# EAGLE design AVR Bus Controller (EAGLE 5.06)
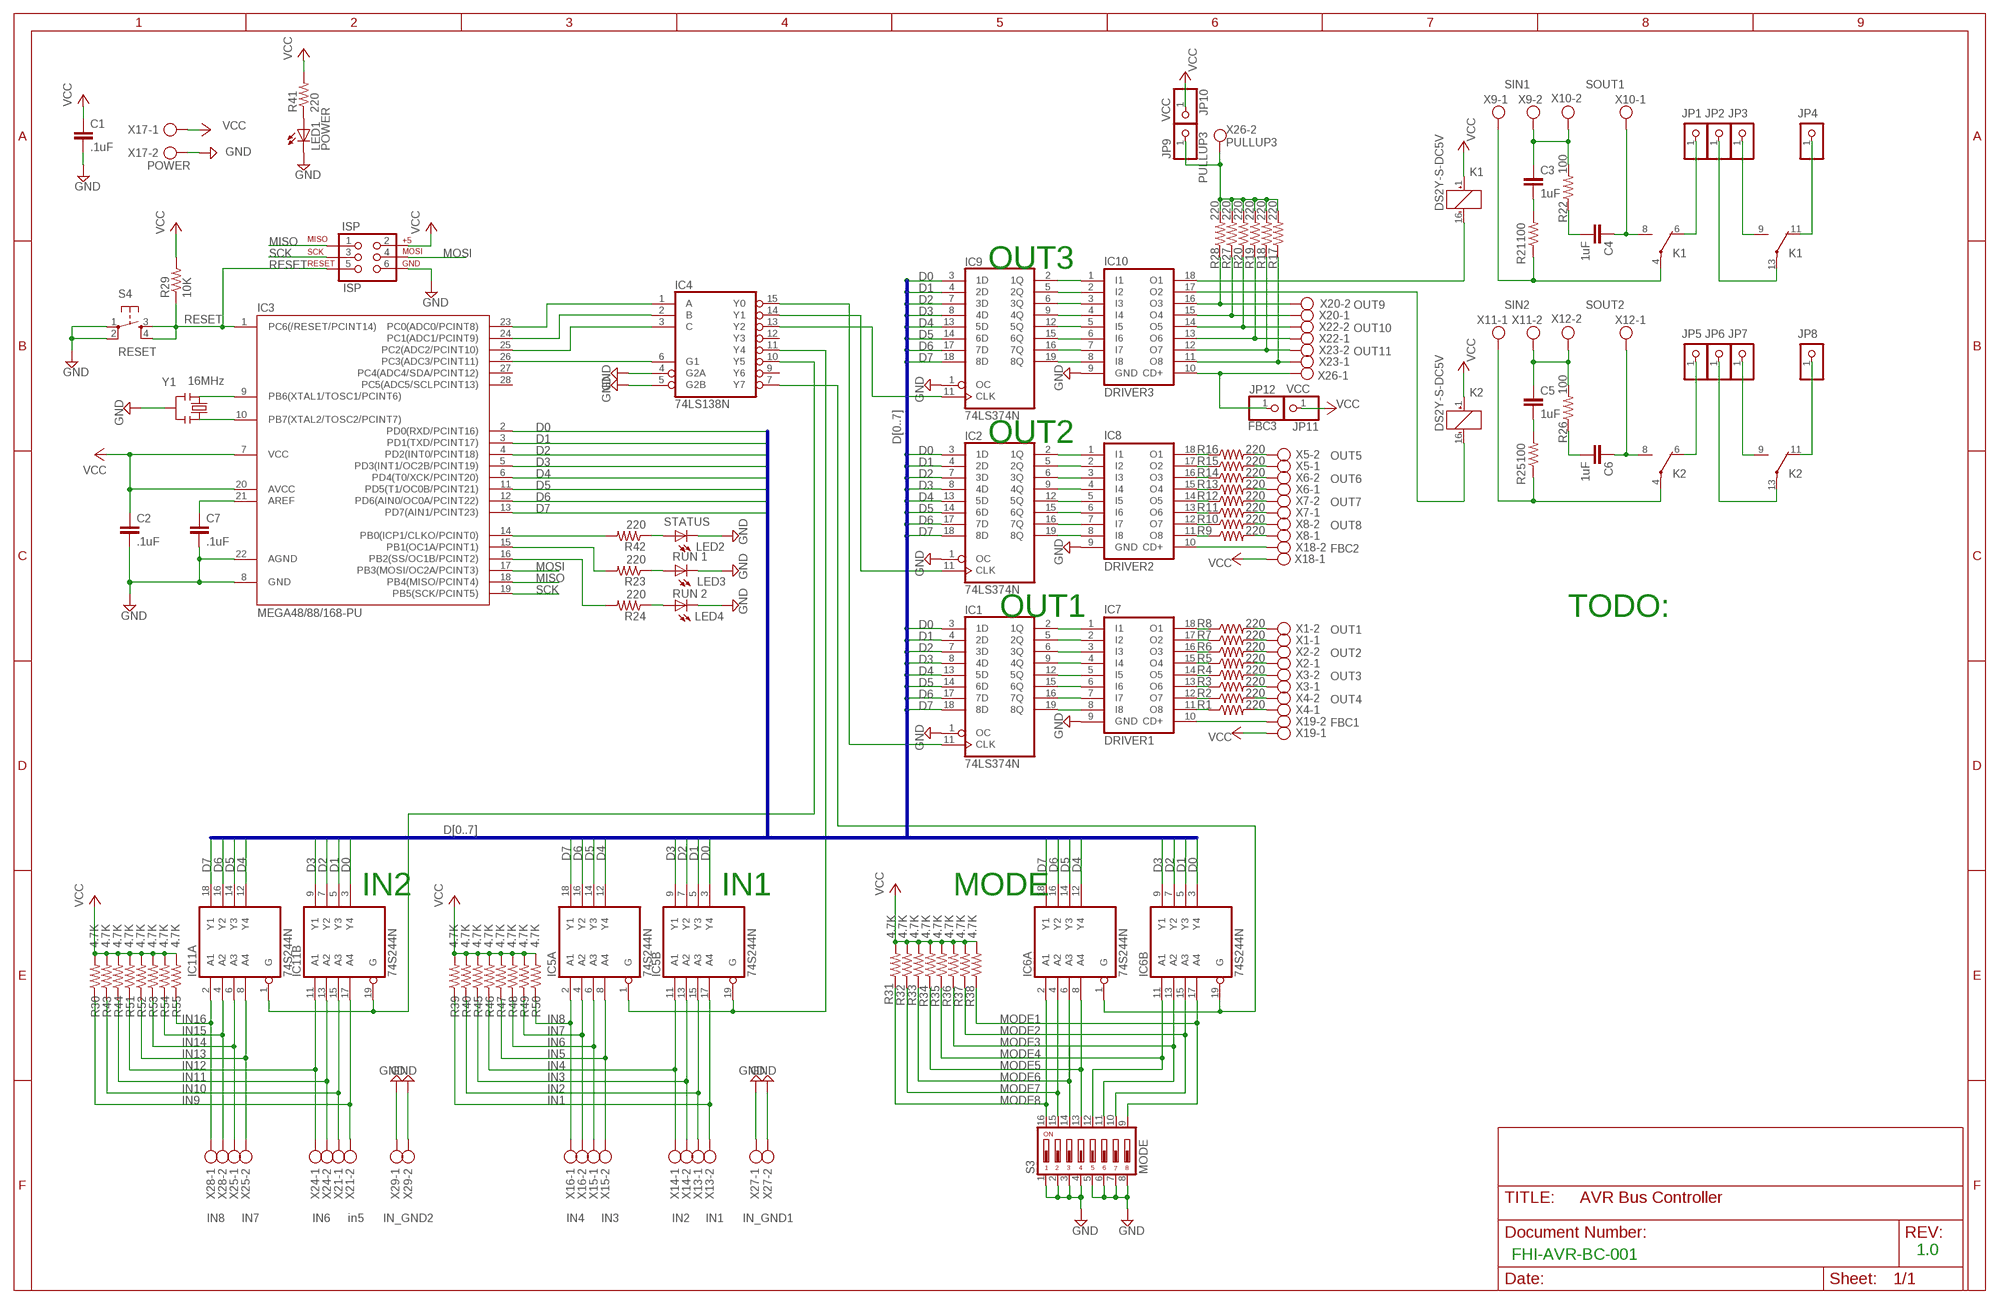
[diagram p0: schematic, sheet 1]

## Parts
C1  .1uF  C-EU025-025X050  [C025-025X050]
C2  .1uF  C-EU025-025X050  [C025-025X050]
C3  1uF  C-EU025-025X050  [C025-025X050]
C4  1uF  C-EU025-025X050  [C025-025X050]
C5  1uF  C-EU025-025X050  [C025-025X050]
C6  1uF  C-EU025-025X050  [C025-025X050]
C7  .1uF  C-EU025-025X050  [C025-025X050]
IC1  74LS374N  [DIL20]
IC2  74LS374N  [DIL20]
IC3  MEGA48/88/168-PU  [DIL28-3]
IC4  74LS138N  [DIL16]
IC5  74S244N  [DIL20]
IC6  74S244N  [DIL20]
IC7  DRIVER1  ULN2803A  [DIL18]
IC8  DRIVER2  ULN2803A  [DIL18]
IC9  74LS374N  [DIL20]
IC10  DRIVER3  ULN2803A  [DIL18]
IC11  74S244N  [DIL20]
ISP  ISP  AVR_SPI_PRG_6PTH  [2X3]
JP1  R1_NC1  PINHD-1X1  [1X01]
JP2  R1_NC1  PINHD-1X1  [1X01]
JP3  R1_NC1  PINHD-1X1  [1X01]
JP4  R1_NC1  PINHD-1X1  [1X01]
JP5  R1_NC1  PINHD-1X1  [1X01]
JP6  R1_NC1  PINHD-1X1  [1X01]
JP7  R1_NC1  PINHD-1X1  [1X01]
JP8  R1_NC1  PINHD-1X1  [1X01]
JP9  PULLUP3  PINHD-1X1  [1X01]
JP10  VCC  PINHD-1X1  [1X01]
JP11  VCC  PINHD-1X1  [1X01]
JP12  FBC3  PINHD-1X1  [1X01]
K1  DS2Y-S-DC5V  [DS2Y]
K2  DS2Y-S-DC5V  [DS2Y]
LED1  POWER  LED5MM  [LED5MM]
LED2  STATUS  LED5MM  [LED5MM]
LED3  RUN 1  LED5MM  [LED5MM]
LED4  RUN 2  LED5MM  [LED5MM]
R1  220  R-US_0207/2V  [0207/2V]
R2  220  R-US_0207/2V  [0207/2V]
R3  220  R-US_0207/2V  [0207/2V]
R4  220  R-US_0207/2V  [0207/2V]
R5  220  R-US_0207/2V  [0207/2V]
R6  220  R-US_0207/2V  [0207/2V]
R7  220  R-US_0207/2V  [0207/2V]
R8  220  R-US_0207/2V  [0207/2V]
R9  220  R-US_0207/2V  [0207/2V]
R10  220  R-US_0207/2V  [0207/2V]
R11  220  R-US_0207/2V  [0207/2V]
R12  220  R-US_0207/2V  [0207/2V]
R13  220  R-US_0207/2V  [0207/2V]
R14  220  R-US_0207/2V  [0207/2V]
R15  220  R-US_0207/2V  [0207/2V]
R16  220  R-US_0207/2V  [0207/2V]
R17  220  R-US_0207/2V  [0207/2V]
R18  220  R-US_0207/2V  [0207/2V]
R19  220  R-US_0207/2V  [0207/2V]
R20  220  R-US_0207/2V  [0207/2V]
R21  100  R-US_0207/2V  [0207/2V]
R22  100  R-US_0207/2V  [0207/2V]
R23  220  R-US_0207/2V  [0207/2V]
R24  220  R-US_0207/2V  [0207/2V]
R25  100  R-US_0207/2V  [0207/2V]
R26  100  R-US_0207/2V  [0207/2V]
R27  220  R-US_0207/2V  [0207/2V]
R28  220  R-US_0207/2V  [0207/2V]
R29  10K  R-US_0207/2V  [0207/2V]
R30  4.7K  R-US_0207/2V  [0207/2V]
R31  4.7K  R-US_0207/2V  [0207/2V]
R32  4.7K  R-US_0207/2V  [0207/2V]
R33  4.7K  R-US_0207/2V  [0207/2V]
R34  4.7K  R-US_0207/2V  [0207/2V]
R35  4.7K  R-US_0207/2V  [0207/2V]
R36  4.7K  R-US_0207/2V  [0207/2V]
R37  4.7K  R-US_0207/2V  [0207/2V]
R38  4.7K  R-US_0207/2V  [0207/2V]
R39  4.7K  R-US_0207/2V  [0207/2V]
R40  4.7K  R-US_0207/2V  [0207/2V]
R41  220  R-US_0207/2V  [0207/2V]
R42  220  R-US_0207/2V  [0207/2V]
R43  4.7K  R-US_0207/2V  [0207/2V]
R44  4.7K  R-US_0207/2V  [0207/2V]
R45  4.7K  R-US_0207/2V  [0207/2V]
R46  4.7K  R-US_0207/2V  [0207/2V]
R47  4.7K  R-US_0207/2V  [0207/2V]
R48  4.7K  R-US_0207/2V  [0207/2V]
R49  4.7K  R-US_0207/2V  [0207/2V]
R50  4.7K  R-US_0207/2V  [0207/2V]
R51  4.7K  R-US_0207/2V  [0207/2V]
R52  4.7K  R-US_0207/2V  [0207/2V]
R53  4.7K  R-US_0207/2V  [0207/2V]
R54  4.7K  R-US_0207/2V  [0207/2V]
R55  4.7K  R-US_0207/2V  [0207/2V]
S3  MODE  DS08  [DS-08]
S4  RESET  TAC_SWITCHPTH  [TACTILE-PTH]
X1  OUT1  AK550/2  [AK550/2]
X2  OUT2  AK550/2  [AK550/2]
X3  OUT3  AK550/2  [AK550/2]
X4  OUT4  AK550/2  [AK550/2]
X5  OUT5  AK550/2  [AK550/2]
X6  OUT6  AK550/2  [AK550/2]
X7  OUT7  AK550/2  [AK550/2]
X8  OUT8  AK550/2  [AK550/2]
X9  SIN1  AK550/2  [AK550/2]
X10  SOUT1  AK550/2  [AK550/2]
X11  SIN2  AK550/2  [AK550/2]
X12  SOUT2  AK550/2  [AK550/2]
X13  IN1  AK550/2  [AK550/2]
X14  IN2  AK550/2  [AK550/2]
X15  IN3  AK550/2  [AK550/2]
X16  IN4  AK550/2  [AK550/2]
X17  POWER  AK500/2  [AK500/2]
X18  FBC2  AK550/2  [AK550/2]
X19  FBC1  AK550/2  [AK550/2]
X20  OUT9  AK550/2  [AK550/2]
X21  in5  AK550/2  [AK550/2]
X22  OUT10  AK550/2  [AK550/2]
X23  OUT11  AK550/2  [AK550/2]
X24  IN6  AK550/2  [AK550/2]
X25  IN7  AK550/2  [AK550/2]
X26  PULLUP3  AK550/2  [AK550/2]
X27  IN_GND1  AK550/2  [AK550/2]
X28  IN8  AK550/2  [AK550/2]
X29  IN_GND2  AK550/2  [AK550/2]
Y1  16MHz  RESONATORPTH  [RESONATOR-PTH]

## Nets
A0: IC3.23(PC0(ADC0/PCINT8)) IC4.1(A)
A1: IC3.24(PC1(ADC1/PCINT9)) IC4.2(B)
A2: IC3.25(PC2(ADC2/PCINT10)) IC4.3(C)
D0: IC1.3(1D) IC2.3(1D) IC3.2(PD0(RXD/PCINT16)) IC5.3(B:Y4) IC6.3(B:Y4) IC9.3(1D) IC11.3(B:Y4)
D1: IC1.4(2D) IC2.4(2D) IC3.3(PD1(TXD/PCINT17)) IC5.5(B:Y3) IC6.5(B:Y3) IC9.4(2D) IC11.5(B:Y3)
D2: IC1.7(3D) IC2.7(3D) IC3.4(PD2(INT0/PCINT18)) IC5.7(B:Y2) IC6.7(B:Y2) IC9.7(3D) IC11.7(B:Y2)
D3: IC1.8(4D) IC2.8(4D) IC3.5(PD3(INT1/OC2B/PCINT19)) IC5.9(B:Y1) IC6.9(B:Y1) IC9.8(4D) IC11.9(B:Y1)
D4: IC1.13(5D) IC2.13(5D) IC3.6(PD4(T0/XCK/PCINT20)) IC5.12(A:Y4) IC6.12(A:Y4) IC9.13(5D) IC11.12(A:Y4)
D5: IC1.14(6D) IC2.14(6D) IC3.11(PD5(T1/OC0B/PCINT21)) IC5.14(A:Y3) IC6.14(A:Y3) IC9.14(6D) IC11.14(A:Y3)
D6: IC1.17(7D) IC2.17(7D) IC3.12(PD6(AIN0/OC0A/PCINT22)) IC5.16(A:Y2) IC6.16(A:Y2) IC9.17(7D) IC11.16(A:Y2)
D7: IC1.18(8D) IC2.18(8D) IC3.13(PD7(AIN1/PCINT23)) IC5.18(A:Y1) IC6.18(A:Y1) IC9.18(8D) IC11.18(A:Y1)
EN_A: IC3.26(PC3(ADC3/PCINT11)) IC4.6(G1)
EN_IN1: IC4.11(Y4) IC5.1(A:G) IC5.19(B:G)
EN_MODE: IC4.7(Y7) IC6.1(A:G) IC6.19(B:G)
EN_OUT1: IC1.11(CLK) IC4.15(Y0)
EN_OUT2: IC2.11(CLK) IC4.14(Y1)
EN_OUT3: IC4.13(Y2) IC9.11(CLK)
FBC1: IC7.10(CD+) X19.2
FBC2: IC8.10(CD+) X18.2
FBC3: IC10.10(CD+) JP12.1 X26.1
GND: C1.2 C2.2 C7.2 IC1.1(OC) IC2.1(OC) IC3.8(GND) IC3.22(AGND) IC4.4(G2A) IC4.5(G2B) IC7.9(GND) IC8.9(GND) IC9.1(OC) IC10.9(GND) ISP.6 LED1.K(C) LED2.K(C) LED3.K(C) LED4.K(C) S3.1 S3.2 S3.3 S3.4 S3.5 S3.6 S3.7 S3.8 S4.1 S4.2 X17.2 X27.1 X27.2 X29.1 X29.2 Y1.2
IN1: IC5.17(B:A4) R39.1 X13.2
IN2: IC5.15(B:A3) R40.1 X13.1
IN3: IC5.13(B:A2) R45.1 X14.2
IN4: IC5.11(B:A1) R46.1 X14.1
IN5: IC5.8(A:A4) R47.1 X15.2
IN6: IC5.6(A:A3) R48.1 X15.1
IN7: IC5.4(A:A2) R49.1 X16.2
IN8: IC5.2(A:A1) R50.1 X16.1
IN9: IC11.17(B:A4) R30.1 X21.2
IN10: IC11.15(B:A3) R43.1 X21.1
IN11: IC11.13(B:A2) R44.1 X24.2
IN12: IC11.11(B:A1) R51.1 X24.1
IN13: IC11.8(A:A4) R52.1 X25.2
IN14: IC11.6(A:A3) R53.1 X25.1
IN15: IC11.4(A:A2) R54.1 X28.2
IN16: IC11.2(A:A1) R55.1 X28.1
MISO: IC3.18(PB4(MISO/PCINT4)) ISP.1
MODE1: IC6.17(B:A4) R38.1 S3.9
MODE2: IC6.15(B:A3) R37.1 S3.10
MODE3: IC6.13(B:A2) R36.1 S3.11
MODE4: IC6.11(B:A1) R35.1 S3.12
MODE5: IC6.8(A:A4) R34.1 S3.13
MODE6: IC6.6(A:A3) R33.1 S3.14
MODE7: IC6.4(A:A2) R32.1 S3.15
MODE8: IC6.2(A:A1) R31.1 S3.16
MOSI: IC3.17(PB3(MOSI/OC2A/PCINT3)) ISP.4
N$1: C3.2 R21.2
N$3: IC4.10(Y5) IC11.1(A:G) IC11.19(B:G)
N$4: IC7.12(O7) R2.1
N$7: IC9.19(8Q) IC10.8(I8)
N$8: IC9.16(7Q) IC10.7(I7)
N$9: IC9.15(6Q) IC10.6(I6)
N$10: IC9.12(5Q) IC10.5(I5)
N$11: IC9.9(4Q) IC10.4(I4)
N$12: IC7.18(O1) R8.1
N$13: IC7.17(O2) R7.1
N$14: IC7.16(O3) R6.1
N$15: IC7.15(O4) R5.1
N$16: IC9.6(3Q) IC10.3(I3)
N$17: IC8.12(O7) R10.1
N$18: IC9.5(2Q) IC10.2(I2)
N$19: IC9.2(1Q) IC10.1(I1)
N$20: IC1.16(7Q) IC7.7(I7)
N$21: IC7.14(O5) R4.1
N$22: IC1.19(8Q) IC7.8(I8)
N$23: IC1.2(1Q) IC7.1(I1)
N$24: IC1.5(2Q) IC7.2(I2)
N$25: IC1.6(3Q) IC7.3(I3)
N$26: IC1.9(4Q) IC7.4(I4)
N$27: IC1.12(5Q) IC7.5(I5)
N$28: IC1.15(6Q) IC7.6(I6)
N$29: IC2.19(8Q) IC8.8(I8)
N$30: IC7.13(O6) R3.1
N$31: IC2.16(7Q) IC8.7(I7)
N$32: IC7.11(O8) R1.1
N$33: IC2.15(6Q) IC8.6(I6)
N$34: C4.2 R22.1
N$35: IC3.9(PB6(XTAL1/TOSC1/PCINT6)) Y1.1
N$36: IC3.10(PB7(XTAL2/TOSC2/PCINT7)) Y1.3
N$37: LED4.A R24.1
N$38: LED3.A R23.1
N$39: C7.1 IC3.21(AREF)
N$44: C5.2 R25.2
N$45: C6.2 R26.1
N$55: IC2.2(1Q) IC8.1(I1)
N$56: IC2.5(2Q) IC8.2(I2)
N$57: IC2.6(3Q) IC8.3(I3)
N$58: IC2.9(4Q) IC8.4(I4)
N$59: IC2.12(5Q) IC8.5(I5)
N$61: IC8.18(O1) R16.1
N$62: IC8.17(O2) R15.1
N$63: IC8.16(O3) R14.1
N$64: IC8.15(O4) R13.1
N$65: IC8.14(O5) R12.1
N$66: IC8.13(O6) R11.1
N$68: IC8.11(O8) R9.1
N$71: LED1.A R41.1
N$106: LED2.A R42.1
OUT1: R8.2 X1.2
OUT2: R7.2 X1.1
OUT3: R6.2 X2.2
OUT4: R5.2 X2.1
OUT5: R4.2 X3.2
OUT6: R3.2 X3.1
OUT7: R2.2 X4.2
OUT8: R1.2 X4.1
OUT9: R16.2 X5.2
OUT10: R15.2 X5.1
OUT11: R14.2 X6.2
OUT12: R13.2 X6.1
OUT13: R12.2 X7.2
OUT14: R11.2 X7.1
OUT15: R10.2 X8.2
OUT16: R9.2 X8.1
OUT17: IC10.18(O1) K1.16(1:-)
OUT18: IC10.17(O2) K2.16(1:-)
OUT19: IC10.16(O3) R28.1 X20.2
OUT20: IC10.15(O4) R27.1 X20.1
OUT21: IC10.14(O5) R20.1 X22.2
OUT22: IC10.13(O6) R19.1 X22.1
OUT23: IC10.12(O7) R18.1 X23.2
OUT24: IC10.11(O8) R17.1 X23.1
PULLUP3: JP9.1 R17.2 R18.2 R19.2 R20.2 R27.2 R28.2 X26.2
R1_C1: K1.4(2:P) R21.1 X9.1
R1_C2: JP2.1 K1.13(3:P)
R1_GND: C3.1 R22.2 X9.2 X10.2
R1_NC1: JP1.1 K1.6(2:O)
R1_NC2: JP4.1 K1.11(3:O)
R1_NO1: C4.1 K1.8(2:S) X10.1
R1_NO2: JP3.1 K1.9(3:S)
R2_C1: K2.4(2:P) R25.1 X11.1
R2_C2: JP6.1 K2.13(3:P)
R2_GND: C5.1 R26.2 X11.2 X12.2
R2_NC1: JP5.1 K2.6(2:O)
R2_NC2: JP8.1 K2.11(3:O)
R2_NO1: C6.1 K2.8(2:S) X12.1
R2_NO2: JP7.1 K2.9(3:S)
RESET: IC3.1(PC6(/RESET/PCINT14)) ISP.5 R29.1 S4.3 S4.4
RUN1: IC3.15(PB1(OC1A/PCINT1)) R23.2
RUN2: IC3.16(PB2(SS/OC1B/PCINT2)) R24.2
SCK: IC3.19(PB5(SCK/PCINT5)) ISP.3
STATUS: IC3.14(PB0(ICP1/CLKO/PCINT0)) R42.2
VCC: C1.1 C2.1 IC3.7(VCC) IC3.20(AVCC) ISP.2 JP10.1 JP11.1 K1.1(1:+) K2.1(1:+) R29.2 R30.2 R31.2 R32.2 R33.2 R34.2 R35.2 R36.2 R37.2 R38.2 R39.2 R40.2 R41.2 R43.2 R44.2 R45.2 R46.2 R47.2 R48.2 R49.2 R50.2 R51.2 R52.2 R53.2 R54.2 R55.2 X17.1 X18.1 X19.1
Unconnected: IC3.27(PC4(ADC4/SDA/PCINT12)) IC3.28(PC5(ADC5/SCLPCINT13)) IC4.9(Y6) IC4.12(Y3)

## Buses
D[0..7]

## Notes on the sheet
- OUT3
- OUT2
- OUT1 | TODO:
- IN2 | IN1 | MODE
- 1.0
- FHI-AVR-BC-001

## Power pins joined to a net without a drawn wire
GND: IC1.10(GND) IC2.10(GND) IC4.8(GND) IC5.10(P:GND) IC6.10(P:GND) IC9.10(GND) IC11.10(P:GND)
VCC: IC1.20(VCC) IC2.20(VCC) IC4.16(VCC) IC5.20(P:VCC) IC6.20(P:VCC) IC9.20(VCC) IC11.20(P:VCC)

## Library data of the parts
C1-C7 = rcl:C-EU: CAPACITOR, European symbol
IC1 IC2 IC9 = 74xx-us:74*374: Octal D type transparent LATCH, edge triggered
IC3 = avr-6:MEGA48/88/168-PU
IC4 = 74xx-eu:74*138: 3-line to 8-line DECODER/DEMULTIPLEXER
IC5 IC6 IC11 = 74xx-us:74*244: Octal BUFFER and LINE DRIVER, 3-state
IC7 IC8 IC10 = uln-udn:ULN2803A: DRIVER ARRAY
ISP = SparkFun:AVR_SPI_PRG_6: AVR ISP 6 Pin This is the reduced ISP connector for AVR programming. Common on Arduino. This footprint will take up less PCB space and can be used with a 10-pin to 6-pin adapter such as SKU: BOB-08508
JP1-JP12 = pinhead:PINHD-1X1: PIN HEADER
K1 K2 = relay:DS2Y-S-DC*: MINIATURE RELAY NAiS Source: http://www.mew-europe.com/.. en_ds_61005_0023.pdf
LED1-LED4 = led:LED: LED OSRAM: - CHIPLED LG R971, LG N971, LY N971, LG Q971, LY Q971, LO R971, LY R971 LH N974, LH R974 LS Q976, LO Q976, LY Q976 LO Q996 - Hyper CHIPLED LW Q18S LB Q993, LB Q99A, LB R99A - SideLED LS A670, LO A670, LY A670, LG A670, LP A670 LB A673, LV A673, LT A673, LW A673 LH A674 LY A675 LS A676, LA A676, LO A676, LY A676, LW A676 LS A679, LY A679, LG A679 - Hyper Micro SIDELED® LS Y876, LA Y876, LO Y876, LY Y876 LT Y87S - SmartLED LW L88C, LW L88S LB L89C, LB L89S, LG L890 LS L89K, LO L89K, LY L89K LS L896, LA L896, LO L896, LY L896 - TOPLED LS T670, LO T670, LY T670, LG T670, LP T670 LSG T670, LSP T670, LSY T670, LOP T670, LYG T670 LG T671, LOG T671, LSG T671 LB T673, LV T673, LT T673, LW T673 LH T674 LS T676, LA T676, LO T676, LY T676, LB T676, LH T676, LSB T676, LW T676 LB T67C, LV T67C, LT T67C, LS T67K, LO T67K, LY T67K, LW E67C LS E67B, LA E67B, LO E67B, LY E67B, LB E67C, LV E67C, LT E67C LW T67C LS T679, LY T679, LG T679 LS T770, LO T770, LY T770, LG T770, LP T770 LB T773, LV T773, LT T773, LW T773 LH T774 LS E675, LA E675, LY E675, LS T675 LS T776, LA T776, LO T776, LY T776, LB T776 LHGB T686 LT T68C, LB T68C - Hyper Mini TOPLED® LB M676 - Mini TOPLED Santana® LG M470 LS M47K, LO M47K, LY M47K Source: http://www.osram.convergy.de - LUMILED® LXK2-PW12-R00, LXK2-PW12-S00, LXK2-PW14-U00, LXK2-PW14-V00 LXK2-PM12-R00, LXK2-PM12-S00, LXK2-PM14-U00 LXK2-PE12-Q00, LXK2-PE12-R00, LXK2-PE12-S00, LXK2-PE14-T00, LXK2-PE14-U00 LXK2-PB12-K00, LXK2-PB12-L00, LXK2-PB12-M00, LXK2-PB14-N00, LXK2-PB14-P00, LXK2-PB14-Q00 LXK2-PR12-L00, LXK2-PR12-M00, LXK2-PR14-Q00, LXK2-PR14-R00 LXK2-PD12-Q00, LXK2-PD12-R00, LXK2-PD12-S00 LXK2-PH12-R00, LXK2-PH12-S00 LXK2-PL12-P00, LXK2-PL12-Q00, LXK2-PL12-R00 Source: www.luxeon.com
R1-R55 = resistor:R-US_: RESISTOR, American symbol
S3 = switch-dil:DS08: DIL/CODE SWITCH
S4 = SparkFun:TAC_SWITCH: Momentary Switch Button commonly used for reset or general input. Spark Fun Electronics SKU : COM-00097
X1-X16 X18-X29 = con-ptr500+_v5:AK550/2: CONNECTOR
X17 = con-ptr500:AK500/2: CONNECTOR
Y1 = SparkFun:RESONATOR: Resonator Small SMD resonator. This is the itty bitty 10/20MHz resonators with built in caps. CSTCE10M0G55 and CSTCE20M0V53. Footprint has been reviewed closely but hasn't been tested yet.

## Board
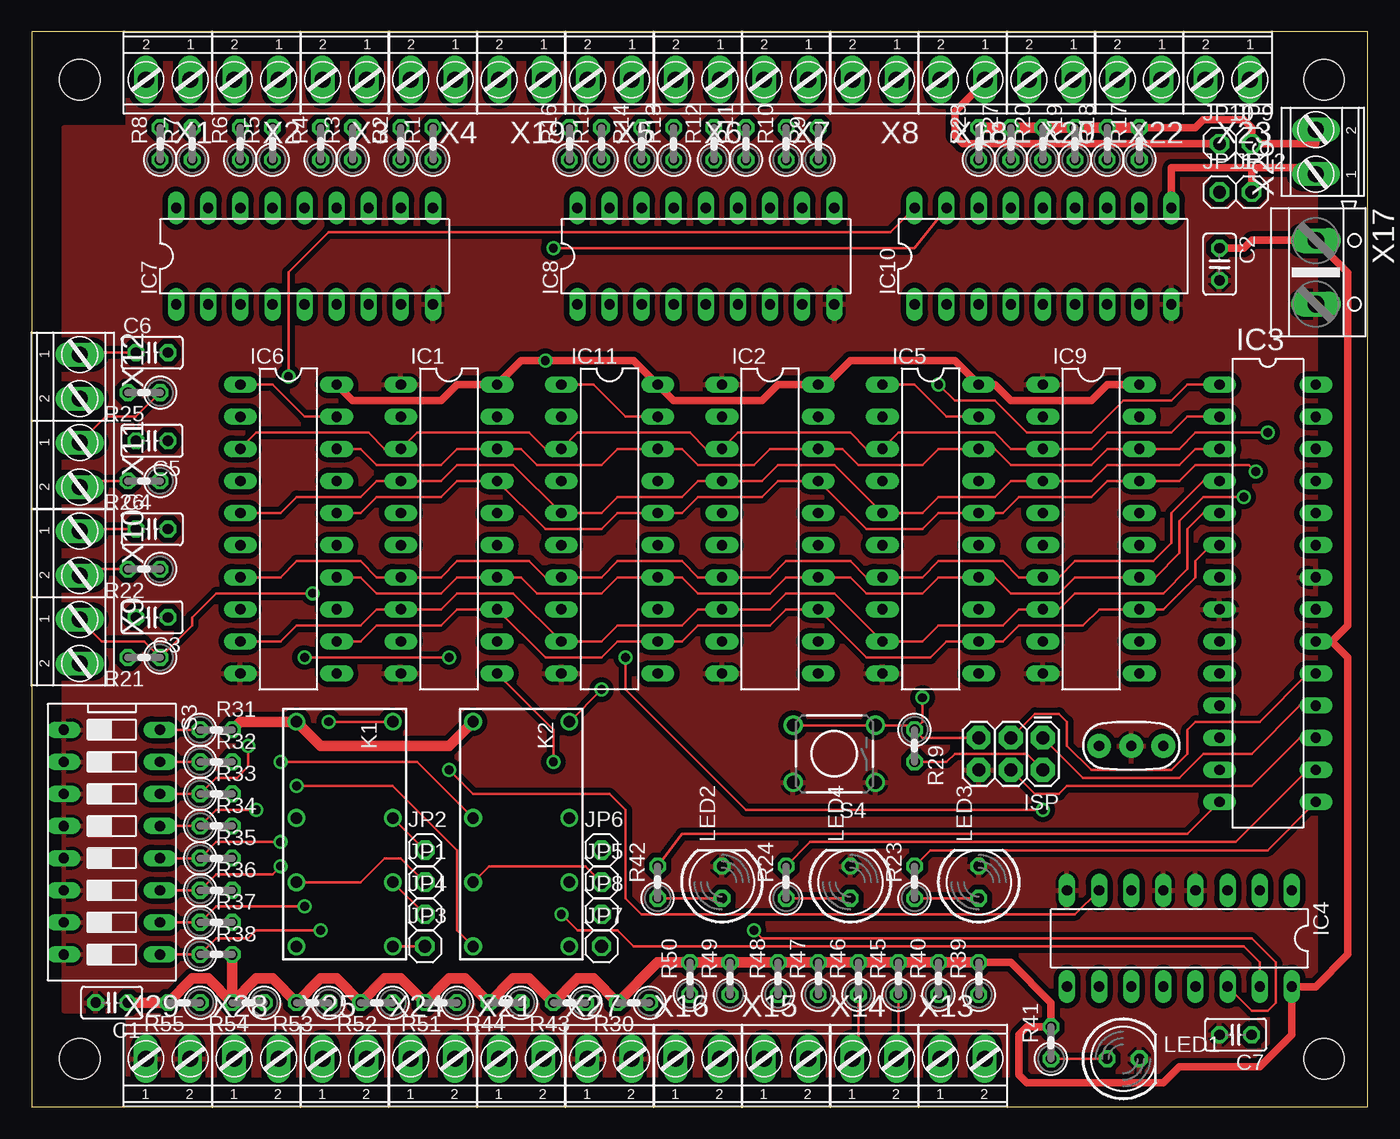
[diagram p1: board, top side]
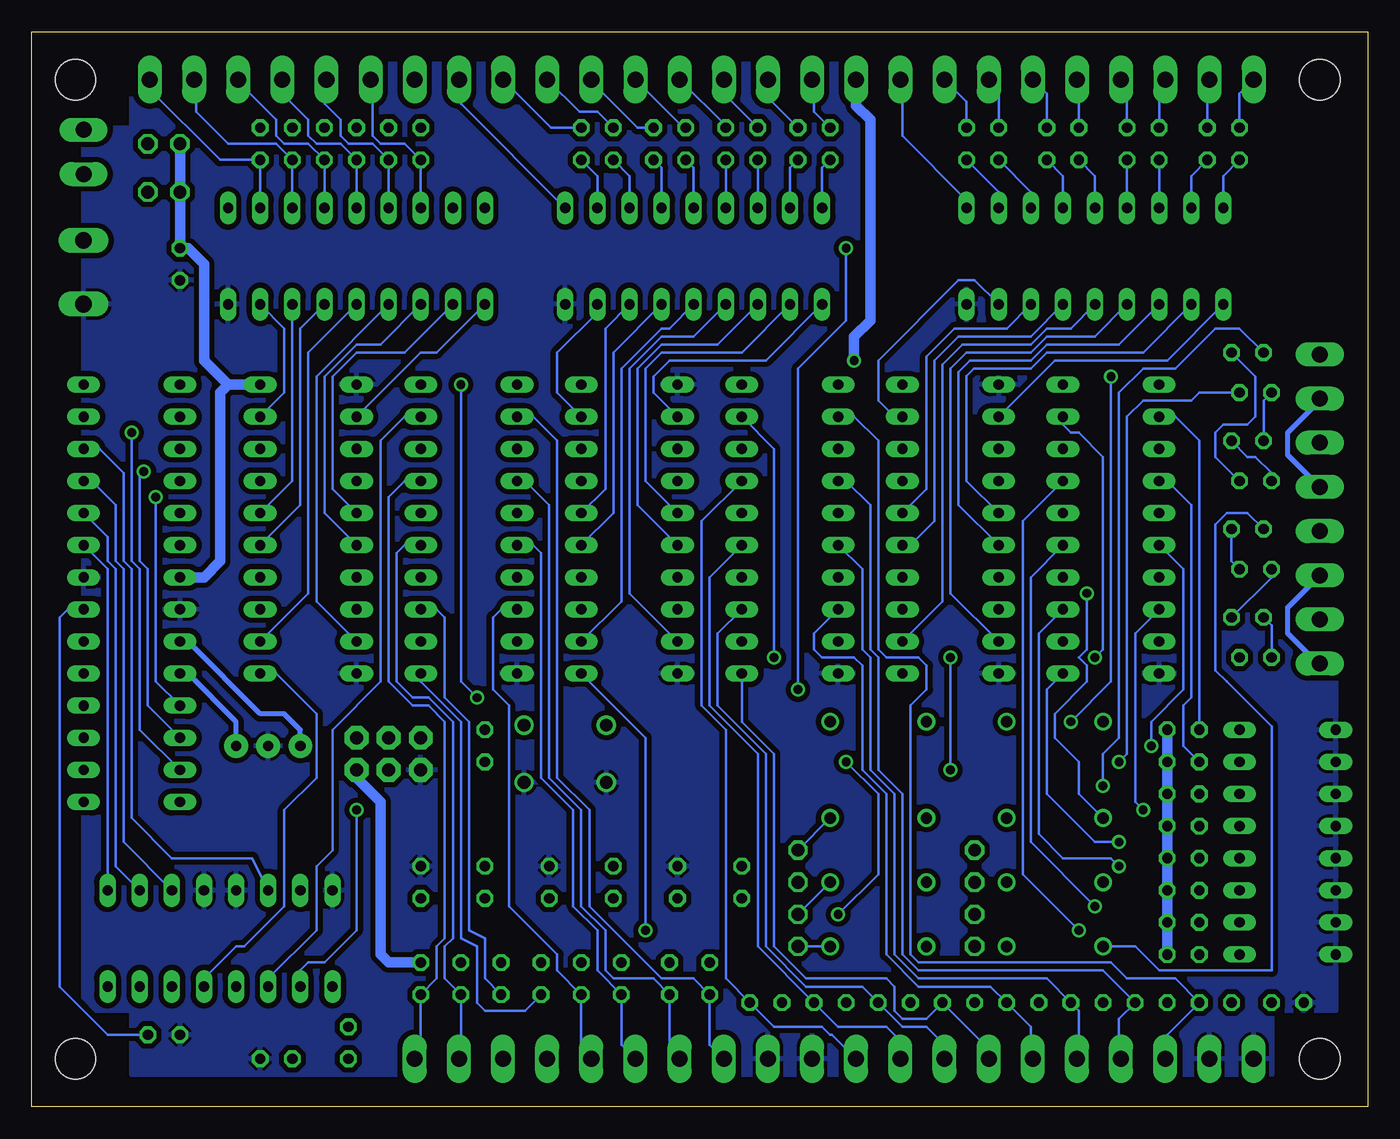
[diagram p2: board, bottom side, seen from below]

Size 105.72 x 85.08 mm. Coordinates in mm from the lower left corner, seen from the top.
Outline: 0,0 105.72,0 105.72,85.08 0,85.08 0,0
Copper layers (1*16): Top 0.035mm / dielectric 1.5mm / Bottom 0.035mm
Design rules "default *": minimum track width 8mil, minimum drill 24mil, track to track 16mil, track to pad 16mil, pad to pad 16mil, via to via 8mil, smd to smd 8mil, copper to edge 40mil, drill to drill 8mil, minimum pad ring 10mil, minimum via ring 8mil, stop-mask expansion 4mil, vias tented up to drill 0mil, thermal gap 10mil
Holes 3.2 mm at 102.23,81.28 102.23,3.81 3.81,3.81 3.81,81.28

### Footprints (pad centres in the part's own frame; a part is rotated, then mirrored left to right if it is on the bottom)
C025-025X050 = drill 0.813 octagon: 1 -1.27,0; 2 1.27,0
DIL20 = drill 0.813 long: 1 -11.43,-3.81; 2 -8.89,-3.81; 3 -6.35,-3.81; 4 -3.81,-3.81; 5 -1.27,-3.81; 6 1.27,-3.81; 7 3.81,-3.81; 8 6.35,-3.81; 9 8.89,-3.81; 10 11.43,-3.81; 11 11.43,3.81; 12 8.89,3.81; 13 6.35,3.81; 14 3.81,3.81; 15 1.27,3.81; 16 -1.27,3.81; 17 -3.81,3.81; 18 -6.35,3.81; 19 -8.89,3.81; 20 -11.43,3.81
DIL28-3 = drill 0.813 long: 1 -16.51,-3.81; 2 -13.97,-3.81; 3 -11.43,-3.81; 4 -8.89,-3.81; 5 -6.35,-3.81; 6 -3.81,-3.81; 7 -1.27,-3.81; 8 1.27,-3.81; 9 3.81,-3.81; 10 6.35,-3.81; 11 8.89,-3.81; 12 11.43,-3.81; 13 13.97,-3.81; 14 16.51,-3.81; 15 16.51,3.81; 16 13.97,3.81; 17 11.43,3.81; 18 8.89,3.81; 19 6.35,3.81; 20 3.81,3.81; 21 1.27,3.81; 22 -1.27,3.81; 23 -3.81,3.81; 24 -6.35,3.81; 25 -8.89,3.81; 26 -11.43,3.81; 27 -13.97,3.81; 28 -16.51,3.81
DIL16 = drill 0.813 long: 1 -8.89,-3.81; 2 -6.35,-3.81; 3 -3.81,-3.81; 4 -1.27,-3.81; 5 1.27,-3.81; 6 3.81,-3.81; 7 6.35,-3.81; 8 8.89,-3.81; 9 8.89,3.81; 10 6.35,3.81; 11 3.81,3.81; 12 1.27,3.81; 13 -1.27,3.81; 14 -3.81,3.81; 15 -6.35,3.81; 16 -8.89,3.81
DIL18 = drill 0.813 long: 1 -10.16,-3.81; 2 -7.62,-3.81; 3 -5.08,-3.81; 4 -2.54,-3.81; 5 0,-3.81; 6 2.54,-3.81; 7 5.08,-3.81; 8 7.62,-3.81; 9 10.16,-3.81; 10 10.16,3.81; 11 7.62,3.81; 12 5.08,3.81; 13 2.54,3.81; 14 0,3.81; 15 -2.54,3.81; 16 -5.08,3.81; 17 -7.62,3.81; 18 -10.16,3.81
2X3 = drill 1.016 pad 1.88 octagon: 1 0,0; 2 0,2.54; 3 2.54,0; 4 2.54,2.54; 5 5.08,0; 6 5.08,2.54
1X01 = drill 1.016 octagon: 1 0,0
DS2Y = drill 0.9 round: 1 -8.89,-3.81; 4 -1.27,-3.81; 6 3.81,-3.81; 8 8.89,-3.81; 9 8.89,3.81; 11 3.81,3.81; 13 -1.27,3.81; 16 -8.89,3.81
LED5MM = drill 0.813 octagon: A -1.27,0; K 1.27,0
0207/2V = drill 0.813 octagon: 1 -1.27,0; 2 1.27,0
DS-08 = drill 0.813 long: 1 -8.89,-3.81; 2 -6.35,-3.81; 3 -3.81,-3.81; 4 -1.27,-3.81; 5 1.27,-3.81; 6 3.81,-3.81; 7 6.35,-3.81; 8 8.89,-3.81; 9 8.89,3.81; 10 6.35,3.81; 11 3.81,3.81; 12 1.27,3.81; 13 -1.27,3.81; 14 -3.81,3.81; 15 -6.35,3.81; 16 -8.89,3.81
TACTILE-PTH = drill 1.016 round: 1 -3.251,2.261; 2 3.251,2.261; 3 -3.251,-2.261; 4 3.251,-2.261
AK550/2 = drill 1.27 long: 1 -1.75,0; 2 1.75,0
AK500/2 = drill 1.321 long: 1 -2.515,0; 2 2.515,0
RESONATOR-PTH = drill 0.8 pad 1.88 round: 1 -2.54,0; 2 0,0; 3 2.54,0

### Placement (x,y rotation side)
C1  6.35,8.26 180 top
C2  93.98,66.67 270 top
C3  9.53,38.73 180 top
C4  9.53,45.72 0 top
C5  9.53,52.7 180 top
C6  9.53,59.69 0 top
C7  95.25,5.71 180 top
IC1  33.02,45.72 270 top
IC2  58.42,45.72 270 top
IC3  97.79,40.64 270 top
IC4  90.81,13.34 180 top
IC5  71.12,45.72 270 top
IC6  20.32,45.72 270 top
IC7  21.59,67.31 0 top
IC8  53.34,67.31 0 top
IC9  83.82,45.72 270 top
IC10  80.01,67.31 0 top
IC11  45.72,45.72 270 top
ISP  80.01,29.21 180 top
JP1  31.11,17.78 0 top
JP2  31.11,20.32 0 top
JP3  31.11,12.7 0 top
JP4  31.11,15.24 0 top
JP5  45.09,17.78 0 top
JP6  45.09,20.32 0 top
JP7  45.09,12.7 0 top
JP8  45.09,15.24 0 top
JP9  96.52,76.2 0 top
JP10  93.98,76.2 0 top
JP11  93.98,72.39 0 top
JP12  96.52,72.39 0 top
K1  24.77,21.59 270 top
K2  38.73,21.59 270 top
LED1  86.36,3.81 0 top
LED2  54.61,17.78 90 top
LED3  74.93,17.78 90 top
LED4  64.77,17.78 90 top
R1  31.75,76.2 90 top
R2  29.21,76.2 90 top
R3  25.4,76.2 90 top
R4  22.86,76.2 90 top
R5  19.05,76.2 90 top
R6  16.51,76.2 90 top
R7  12.7,76.2 90 top
R8  10.16,76.2 90 top
R9  62.23,76.2 90 top
R10  59.69,76.2 90 top
R11  56.52,76.2 90 top
R12  53.98,76.2 90 top
R13  50.8,76.2 90 top
R14  48.26,76.2 90 top
R15  45.09,76.2 90 top
R16  42.55,76.2 90 top
R17  87.63,76.2 90 top
R18  85.09,76.2 90 top
R19  82.55,76.2 90 top
R20  80.01,76.2 90 top
R21  8.89,35.56 180 top
R22  8.89,42.55 180 top
R23  69.85,17.78 90 top
R24  59.69,17.78 90 top
R25  8.89,56.52 180 top
R26  8.89,49.53 180 top
R27  77.47,76.2 90 top
R28  74.93,76.2 90 top
R29  69.85,28.57 270 top
R30  47.62,8.26 180 top
R31  14.61,29.84 0 top
R32  14.61,27.3 0 top
R33  14.61,24.77 0 top
R34  14.61,22.23 0 top
R35  14.61,19.68 0 top
R36  14.61,17.14 0 top
R37  14.61,14.61 0 top
R38  14.61,12.06 0 top
R39  74.93,10.16 90 top
R40  71.75,10.16 90 top
R41  80.64,5.08 90 top
R42  49.53,17.78 90 top
R43  42.55,8.26 180 top
R44  37.47,8.26 180 top
R45  68.58,10.16 90 top
R46  65.41,10.16 90 top
R47  62.23,10.16 90 top
R48  59.05,10.16 90 top
R49  55.24,10.16 90 top
R50  52.07,10.16 90 top
R51  32.38,8.26 180 top
R52  27.3,8.26 180 top
R53  22.23,8.26 180 top
R54  17.14,8.26 180 top
R55  12.06,8.26 180 top
S3  6.35,20.95 270 top
S4  63.5,27.94 180 top
X1  10.79,81.28 180 top
X2  17.78,81.28 180 top
X3  24.77,81.28 180 top
X4  31.75,81.28 180 top
X5  45.72,81.28 180 top
X6  52.7,81.28 180 top
X7  59.69,81.28 180 top
X8  66.67,81.28 180 top
X9  3.81,36.83 270 top
X10  3.81,43.81 270 top
X11  3.81,50.8 270 top
X12  3.81,57.78 270 top
X13  73.66,3.81 0 top
X14  66.67,3.81 0 top
X15  59.69,3.81 0 top
X16  52.7,3.81 0 top
X17  101.6,66.04 270 top
X18  73.66,81.28 180 top
X19  38.73,81.28 180 top
X20  80.64,81.28 180 top
X21  38.73,3.81 0 top
X22  87.63,81.28 180 top
X23  94.61,81.28 180 top
X24  31.75,3.81 0 top
X25  24.77,3.81 0 top
X26  101.6,75.56 90 top
X27  45.72,3.81 0 top
X28  17.78,3.81 0 top
X29  10.79,3.81 0 top
Y1  87,28.57 0 top

### Tracks (layer width: path | path; a pad name or v marks a point on that pad's centre or on a via)
A0
  Bottom 0.203: IC3.23 99.69,42.55 IC4.1
A1
  Bottom 0.203: IC4.2 99.06,19.05 99.06,42.55 99.69,43.18 99.69,45.09 IC3.24
A2
  Bottom 0.203: IC4.3 98.42,20.95 98.42,42.55 99.06,43.18 99.06,47.62 100.97,49.53 IC3.25
D0
  Top 0.203: IC6.3 17.78,53.34 26.67,53.34 27.94,52.07 IC1.3 30.48,53.34 39.37,53.34 40.64,52.07 IC11.3 43.18,53.34 52.07,53.34 53.34,52.07 IC2.3 55.88,53.34 64.77,53.34 66.04,52.07 IC5.3 68.58,53.34 76.2,53.34 77.47,52.07 IC9.3 83.82,52.07 85.09,53.34 90.17,53.34 91.44,54.61 IC3.2
D1
  Top 0.203: IC6.5 19.68,46.99 20.95,48.26 26.04,48.26 27.3,49.53 IC1.4 32.38,49.53 33.66,50.8 38.1,50.8 IC11.5 45.09,46.99 46.35,48.26 51.44,48.26 52.7,49.53 IC2.4 57.78,49.53 59.05,50.8 63.5,50.8 IC5.5 70.48,46.99 71.75,48.26 76.2,48.26 77.47,49.53 IC9.4 83.82,49.53 85.09,50.8 90.81,50.8 92.08,52.07 IC3.3
D2
  Top 0.203: IC6.7 19.68,41.91 20.95,43.18 26.04,43.18 27.3,41.91 IC1.7 32.38,41.91 33.66,43.18 39.37,43.18 40.64,41.91 IC11.7 45.09,41.91 46.35,43.18 51.44,43.18 52.7,41.91 IC2.7 58.42,41.91 59.69,43.18 64.77,43.18 66.04,41.91 IC5.7 70.48,41.91 71.75,43.18 76.83,43.18 78.11,41.91 IC9.7 81.28,41.91 82.55,43.18 88.75,43.18 90.17,44.6 90.17,46.99 92.71,49.53 IC3.4
D3
  Top 0.203: IC6.9 19.68,36.83 20.95,38.1 26.04,38.1 27.3,39.37 IC1.8 32.38,39.37 33.66,40.64 38.1,40.64 IC11.9 45.09,36.83 46.35,38.1 51.44,38.1 52.7,39.37 IC2.8 58.42,39.37 59.69,40.64 63.5,40.64 IC5.9 70.48,36.83 71.75,38.1 76.83,38.1 78.11,39.37 IC9.8 81.28,39.37 82.55,40.64 89.53,40.64 91.44,42.55 91.44,45.72 92.71,46.99 IC3.5
D4
  Top 0.203: IC6.12 26.04,36.83 27.3,38.1 32.38,38.1 33.66,39.37 IC1.13 40.64,35.56 45.09,35.56 46.35,36.83 IC11.12 51.44,36.83 52.7,38.1 58.42,38.1 59.69,39.37 IC2.13 66.04,35.56 71.12,35.56 72.39,36.83 IC5.12 76.83,36.83 78.11,38.1 83.19,38.1 84.45,39.37 IC9.13 89.53,39.37 92.08,41.91 92.08,43.18 93.34,44.45 IC3.6
D5  (via drill 0.7)
  Top 0.203: IC6.14 26.04,41.91 27.3,40.64 32.38,40.64 33.66,41.91 IC1.14 38.73,41.91 40.01,40.64 45.09,40.64 46.35,41.91 IC11.14 51.44,41.91 52.7,40.64 58.42,40.64 59.69,41.91 IC2.14 64.77,41.91 66.04,40.64 70.48,40.64 71.75,41.91 IC5.14 76.2,41.91 77.47,40.64 81.28,40.64 82.55,41.91 IC9.14 88.9,41.91 90.81,43.81 90.81,46.35 92.71,48.26 v95.89,48.26
  Bottom 0.203: v95.89,48.26 95.89,33.66 IC3.11
D6  (via drill 0.7)
  Top 0.203: IC6.16 26.04,46.99 27.3,48.26 32.38,48.26 33.66,49.53 IC1.17 40.64,45.72 45.09,45.72 46.35,46.99 IC11.16 51.44,46.99 52.7,48.26 57.78,48.26 59.05,49.53 IC2.17 66.04,45.72 70.48,45.72 71.75,46.99 IC5.16 76.83,46.99 78.11,48.26 83.82,48.26 85.09,49.53 IC9.17 90.81,49.53 92.08,50.8 96.31,50.8 v96.84,50.27
  Bottom 0.203: v96.84,50.27 97.16,49.85 97.16,43.18 96.52,42.55 96.52,31.75 IC3.12
D7  (via drill 0.7)
  Top 0.203: IC6.18 26.04,52.07 27.3,50.8 32.38,50.8 33.66,52.07 IC1.18 38.73,52.07 40.01,50.8 45.09,50.8 46.35,52.07 IC11.18 51.44,52.07 52.7,50.8 57.15,50.8 58.42,52.07 IC2.18 64.14,52.07 65.41,50.8 70.48,50.8 71.75,52.07 IC5.18 76.2,52.07 77.47,50.8 83.82,50.8 85.09,52.07 IC9.18 90.81,52.07 92.08,53.34 97.77,53.34 v97.79,53.36
  Bottom 0.203: v97.79,53.36 97.79,43.18 97.16,42.55 97.16,29.84 IC3.13
EN_A
  Bottom 0.203: IC4.6 88.27,19.68 94.61,19.68 97.79,22.86 97.79,42.55 98.42,43.18 98.42,50.16 100.33,52.07 IC3.26
EN_IN1
  Top 0.203: IC5.19 72.39,54.61 69.85,57.15 IC5.1
  Bottom 0.203: IC5.19 76.2,54.61 78.11,52.7 78.11,33.66 81.92,29.84 81.92,20.32 83.19,19.05 83.19,13.97 87,10.16 IC4.11
EN_MODE  (via drill 0.7)
  Top 0.203: IC6.19 21.59,54.61 19.05,57.15 IC6.1 | IC4.7 82.55,15.24 48.26,15.24 46.99,16.51 46.99,23.5 45.72,24.77 34.92,24.77 v33.02,26.67 | v21.59,35.56 v33.02,35.56
  Bottom 0.203: IC6.19 24.13,53.98 23.5,53.34 22.86,53.34 20.95,51.44 20.95,36.2 v21.59,35.56 | v33.02,35.56 v33.02,26.67
EN_OUT1  (via drill 0.7)
  Top 0.203: IC4.15 97.16,11.43 95.89,12.7 47.62,12.7 46.35,13.97 43.18,13.97 v41.91,15.24 | v41.27,27.3 41.27,29.84 IC1.11
  Bottom 0.203: v41.91,15.24 38.73,18.41 38.73,24.77 v41.27,27.3
EN_OUT2  (via drill 0.7)
  Top 0.203: IC4.14 96.52,7.62 97.79,7.62 98.42,8.26 98.42,11.43 96.52,13.34 57.78,13.34 v57.15,13.97
  Bottom 0.203: IC2.11 57.15,29.21 v57.15,13.97
EN_OUT3
  Bottom 0.203: IC9.11 86.36,34.29 83.19,31.11 83.19,26.04 85.72,23.5 85.72,15.88 88.9,12.7 89.53,12.7 92.08,10.16 IC4.13
FBC1
  Bottom 0.203: IC7.10 31.75,71.75 36.83,76.83 36.83,81.12 X19.2
FBC2
  Bottom 0.203: IC8.10 71.75,79.38 71.75,81.12 X18.2
FBC3
  Top 0.61: 96.52,74.3 JP12.1 96.52,73.66 | 96.52,74.3 90.17,74.3 IC10.10 | X26.1 101.44,73.81 100.97,74.3 96.52,74.3
  Top 0.813: JP12.1 96.67,72.55
GND
  pour Top: 7.62,82.55 7.62,77.47 2.54,77.47 2.54,7.62 7.62,7.62 7.62,2.54 97.79,2.54 97.79,7.62 101.6,7.62 101.6,77.47 97.79,77.47 97.79,82.55
  pour Bottom: 7.62,82.55 7.62,77.47 2.54,77.47 2.54,7.62 7.62,7.62 7.62,2.54 97.79,2.54 97.79,7.62 101.6,7.62 101.6,77.47 97.79,77.47 97.79,82.55
IN1
  Bottom 0.203: IC5.17 76.2,49.53 77.47,48.26 77.47,33.66 75.56,31.75 74.3,31.75 73.03,30.48 73.03,13.34 73.66,12.7 73.66,10.16 R39.1 74.93,4.29 X13.2
IN2
  Bottom 0.203: IC5.15 76.2,44.45 76.83,43.81 76.83,33.66 75.56,32.38 74.3,32.38 72.39,30.48 72.39,13.34 73.03,12.7 73.03,10.16 R40.1 71.75,3.96 X13.1
IN3
  Top 0.203: R45.1 68.58,3.96 X14.2
  Bottom 0.203: R45.1 69.85,10.16 69.85,13.34 71.12,13.97 71.12,30.48 73.03,32.38 73.03,38.73 73.66,39.37 IC5.13
IN4
  Top 0.203: R46.1 65.41,4.29 X14.1
  Bottom 0.203: IC5.11 74.93,33.66 71.75,30.48 71.75,13.34 70.48,12.7 70.48,8.26 69.85,7.62 66.67,7.62 R46.1
IN5
  Bottom 0.203: IC5.8 68.58,39.37 69.22,38.73 69.22,33.02 67.94,31.75 67.94,15.88 64.14,12.06 64.14,10.79 R47.1 62.23,4.6 X15.2
IN6
  Bottom 0.203: IC5.6 66.04,44.45 65.41,43.81 65.41,26.04 62.87,23.5 62.87,15.88 60.96,13.97 60.96,10.79 R48.1 59.05,4.92 X15.1
IN7
  Bottom 0.203: IC5.4 66.67,49.53 64.77,47.62 64.77,26.04 62.23,23.5 62.23,15.88 60.33,13.97 60.33,10.79 59.69,10.16 56.52,10.16 R49.1 55.24,4.6 X16.2
IN8
  Bottom 0.203: IC5.2 66.04,54.61 64.14,52.7 64.14,26.04 61.59,23.5 61.59,15.88 55.88,10.16 53.34,10.16 R50.1 52.07,4.92 X16.1
IN9
  Bottom 0.203: IC11.17 52.7,46.35 52.7,31.75 50.8,29.84 50.8,10.16 R30.1 46.99,6.35 43.18,6.35 42.55,5.71 42.39,5.71 X21.2
IN10
  Bottom 0.203: IC11.15 52.07,41.91 52.07,31.75 48.26,27.94 48.26,12.7 R43.1 41.91,6.35 38.1,6.35 36.83,5.08 36.83,3.96 X21.1
IN11
  Bottom 0.203: IC11.13 51.44,37.47 51.44,31.75 47.62,27.94 47.62,12.7 44.45,9.53 40.01,9.53 R44.1 36.83,6.35 34.92,6.35 33.66,5.08 33.66,3.96 X24.2
IN12
  Bottom 0.203: X24.1 29.84,3.96 29.84,4.45 R51.1 34.92,6.99 36.83,6.99 37.47,7.62 37.47,9.53 38.1,10.16 44.45,10.16 46.99,12.7 46.99,27.94 49.53,30.48 IC11.11
IN13
  Bottom 0.203: X25.2 26.67,3.96 26.67,6.35 R52.1 29.84,9.53 35.56,9.53 38.1,12.06 38.1,24.77 40.01,26.67 40.01,34.92 40.64,35.56 43.18,35.56 43.81,36.2 43.81,37.47 IC11.8
IN14
  Bottom 0.203: IC11.6 40.01,42.55 40.01,36.2 39.37,35.56 39.37,26.67 37.47,24.77 37.47,12.06 35.56,10.16 25.4,10.16 R53.1 22.86,7.62 22.86,3.96 X25.1
IN15
  Bottom 0.203: IC11.4 41.27,49.53 39.37,47.62 39.37,36.2 38.73,35.56 38.73,26.67 36.83,24.77 36.83,12.06 35.56,10.79 20.95,10.79 R54.1 19.68,6.99 19.68,3.96 X28.2
IN16
  Bottom 0.203: IC11.2 40.64,54.61 38.73,52.7 38.73,36.2 38.1,35.56 35.56,35.56 34.92,34.92 34.92,33.02 36.2,31.75 36.2,12.06 35.56,11.43 20.32,11.43 19.05,10.16 15.24,10.16 R55.1 15.88,5.71 15.88,3.96 X28.1
MISO
  Top 0.203: IC3.18 100.33,31.75 96.52,27.94 92.71,27.94 90.81,26.04 83.19,26.04 ISP.1
MODE1  (via drill 0.7)
  Top 0.203: S3.9 R38.1 14.61,13.34 17.14,13.34 17.78,13.97 v22.86,13.97
  Bottom 0.203: IC6.17 27.3,46.35 27.3,18.41 v22.86,13.97
MODE2  (via drill 0.7)
  Top 0.203: S3.10 R37.1 14.61,15.88 v21.59,15.88
  Bottom 0.203: IC6.15 26.67,41.91 26.67,20.95 v21.59,15.88
MODE3  (via drill 0.7)
  Top 0.203: S3.11 R36.1 14.61,18.41 19.05,18.41 v19.68,19.05
  Bottom 0.203: IC6.13 26.04,37.47 26.04,21.59 24.13,19.68 20.32,19.68 v19.68,19.05
MODE4  (via drill 0.7)
  Top 0.203: S3.12 R35.1 14.61,20.95 v19.68,20.95
  Bottom 0.203: v19.68,20.95 21.59,20.95 25.4,24.77 25.4,33.02 IC6.11
MODE5  (via drill 0.7)
  Top 0.203: S3.13 R34.1 14.61,23.5 v17.78,23.5
  Bottom 0.203: IC6.8 18.41,37.47 18.41,24.13 v17.78,23.5
MODE6  (via drill 0.7)
  Top 0.203: S3.14 R33.1 14.61,26.04 16.25,26.04 17.14,26.93 v17.14,28.57
  Bottom 0.203: IC6.6 14.61,42.55 14.61,33.02 17.14,30.48 v17.14,28.57
MODE7
  Top 0.203: S3.15 R32.1
  Bottom 0.203: R32.1 14.61,28.57 14.61,31.75 13.97,32.38 13.97,47.62 15.88,49.53 IC6.4
MODE8
  Top 0.203: S3.16 R31.1
  Bottom 0.203: IC6.2 15.24,54.61 13.34,52.7 R31.1
MOSI
  Top 0.203: IC3.17 100.33,29.21 96.52,25.4 81.92,25.4 81.28,24.77 79.38,24.77 ISP.4
N$1
  Bottom 0.203: R21.2 7.62,38.1 C3.2
N$3  (via drill 0.7)
  Top 0.203: IC11.19 46.99,54.61 44.45,57.15 IC11.1 | v46.99,35.56 46.99,33.02 56.52,23.5 v80.01,23.5
  Bottom 0.203: IC11.19 46.99,52.07 v46.99,35.56 | v80.01,23.5 80.01,13.97 82.55,11.43 83.82,11.43 84.45,10.79 IC4.10
N$4
  Bottom 0.203: IC7.12 26.67,72.39 R2.1
N$7
  Bottom 0.203: IC9.19 85.72,56.52 85.72,61.59 IC10.8
N$8
  Bottom 0.203: IC9.16 85.09,49.53 IC10.7
N$9
  Bottom 0.203: IC9.15 84.45,47.62 84.45,61.59 IC10.6
N$10
  Bottom 0.203: IC9.12 83.82,40.64 83.82,59.69 IC10.5
N$11
  Bottom 0.203: IC9.9 83.19,40.01 83.19,57.78 IC10.4
N$12
  Bottom 0.203: IC7.18 11.43,73.66 R8.1
N$13
  Bottom 0.203: IC7.17 13.97,73.66 R7.1
N$14
  Bottom 0.203: IC7.16 R6.1
N$15
  Bottom 0.203: IC7.15 R5.1
N$16
  Bottom 0.203: IC9.6 82.55,46.99 82.55,57.78 80.01,60.33 78.11,60.33 IC10.3
N$17
  Bottom 0.203: IC8.12 58.42,73.66 R10.1
N$18
  Bottom 0.203: IC9.5 81.92,48.9 81.92,57.78 80.01,59.69 76.2,59.69 IC10.2
N$19
  Bottom 0.203: IC9.2 74.93,59.69 73.66,59.69 IC10.1
N$20
  Bottom 0.203: IC1.16 34.92,48.9 34.92,59.37 32.7,61.59 28.57,61.59 IC7.7
N$21
  Bottom 0.203: IC7.14 21.59,73.66 R4.1
N$22
  Bottom 0.203: IC1.19 37.47,54.61 38.73,55.88 38.73,59.05 32.38,65.41 31.11,65.41 IC7.8
N$23
  Bottom 0.203: IC7.1 15.88,59.05 24.77,59.05 IC1.2
N$24
  Bottom 0.203: IC1.5 31.75,49.53 31.75,57.84 31.17,58.42 26.67,58.42 25.4,59.69 17.78,59.69 IC7.2
N$25
  Bottom 0.203: IC1.6 32.38,47.62 32.38,58.16 31.49,59.05 26.67,59.05 25.4,60.33 19.68,60.33 IC7.3
N$26
  Bottom 0.203: IC1.9 33.02,40.64 33.02,58.42 31.75,59.69 26.67,59.69 25.4,60.96 21.59,60.96 IC7.4
N$27
  Bottom 0.203: IC1.12 33.66,40.01 33.66,58.74 32.07,60.33 26.67,60.33 25.4,61.59 23.5,61.59 IC7.5
N$28
  Bottom 0.203: IC1.15 36.2,44.45 34.29,46.35 34.29,59.05 32.38,60.96 26.67,60.96 IC7.6
N$29
  Bottom 0.203: IC2.19 64.14,56.52 64.14,59.69 60.96,62.87 IC8.8
N$30
  Bottom 0.203: IC7.13 24.13,73.66 R3.1
N$31
  Bottom 0.203: IC2.16 60.33,48.9 60.33,61.59 IC8.7
N$32
  Bottom 0.203: IC7.11 29.21,72.39 R1.1
N$33
  Bottom 0.203: IC2.15 59.69,46.99 59.69,59.69 IC8.6
N$34
  Bottom 0.203: R22.1 10.79,43.18 C4.2
N$35
  Bottom 0.406: Y1.1 84.45,29.84 85.72,31.11 87.63,31.11 93.34,36.83 IC3.9
N$36
  Bottom 0.406: Y1.3 89.53,30.48 93.34,34.29 IC3.10
N$37
  Top 0.203: R24.1 LED4.A
N$38
  Top 0.203: R23.1 LED3.A
N$39
  Bottom 0.203: IC3.21 102.87,39.37 103.5,38.73 103.5,9.53 99.69,5.71 C7.1
N$44
  Bottom 0.203: C5.2 8.26,55.88 R25.2
N$45
  Bottom 0.203: C6.2 8.89,57.78 8.89,54.61 9.53,53.98 11.43,53.98 12.06,53.34 12.06,51.44 R26.1
N$55
  Bottom 0.203: IC2.2 56.52,56.52 56.52,57.78 55.24,59.05 47.62,59.05 IC8.1
N$56
  Bottom 0.203: IC2.5 57.15,49.53 57.15,58.42 55.88,59.69 49.53,59.69 IC8.2
N$57
  Bottom 0.203: IC2.6 57.78,47.62 57.78,58.42 55.88,60.33 51.44,60.33 IC8.3
N$58
  Bottom 0.203: IC2.9 58.42,40.64 58.42,58.42 55.88,60.96 53.34,60.96 IC8.4
N$59
  Bottom 0.203: IC2.12 59.05,40.01 59.05,58.42 55.88,61.59 55.24,61.59 IC8.5
N$61
  Bottom 0.203: IC8.18 43.18,74.3 R16.1
N$62
  Bottom 0.203: IC8.17 45.72,74.3 R15.1
N$63
  Bottom 0.203: IC8.16 R14.1
N$64
  Bottom 0.203: IC8.15 R13.1
N$65
  Bottom 0.203: IC8.14 53.34,74.3 R12.1
N$66
  Bottom 0.203: IC8.13 55.88,74.3 R11.1
N$68
  Bottom 0.203: IC8.11 60.96,73.66 R9.1
N$71
  Top 0.203: R41.1 LED1.A
N$106
  Top 0.203: R42.1 LED2.A
OUT1
  Bottom 0.203: R8.2 10.16,80.17 X1.2
OUT2
  Bottom 0.203: R7.2 12.7,81.12 X1.1
OUT3
  Bottom 0.203: R6.2 16.51,80.8 X2.2
OUT4
  Bottom 0.203: R5.2 19.05,80.8 X2.1
OUT5
  Bottom 0.203: R4.2 22.86,81.12 X3.2
OUT6
  Bottom 0.203: R3.2 25.4,80.17 X3.1
OUT7
  Bottom 0.203: R2.2 29.21,80.49 X4.2
OUT8
  Bottom 0.203: R1.2 31.75,79.53 X4.1
OUT9
  Bottom 0.203: R16.2 43.81,78.74 43.81,81.12 X5.2
OUT10
  Bottom 0.203: R15.2 47.62,80.01 47.62,81.12 X5.1
OUT11
  Bottom 0.203: R14.2 50.8,80.01 50.8,81.12 X6.2
OUT12
  Bottom 0.203: R13.2 50.8,77.62 X6.1
OUT13
  Bottom 0.203: R12.2 54.13,77.47 X7.2
OUT14
  Bottom 0.203: R11.2 57.78,77.47 60.96,80.64 60.96,80.8 X7.1
OUT15
  Bottom 0.203: R10.2 60.96,78.74 62.38,78.74 X8.2
OUT16
  Bottom 0.203: R9.2 64.61,77.47 X8.1
OUT17  (via drill 0.7)
  Top 0.203: IC10.18 67.94,69.22 23.5,69.22 20.32,66.04 v20.32,57.78 | v23.5,30.48 K1.16
  Bottom 0.203: v23.5,30.48 20.32,33.66 v20.32,57.78
OUT18  (via drill 0.7)
  Top 0.203: IC10.17 69.85,67.94 v41.27,67.94 | K2.16 v45.09,33.02
  Bottom 0.203: v45.09,33.02 45.09,58.42 41.27,62.23 v41.27,67.94
OUT19
  Bottom 0.203: IC10.16 R28.1 76.2,76.2 78.11,76.2 78.74,76.83 78.74,81.12 X20.2
OUT20
  Bottom 0.203: IC10.15 R27.1 78.74,76.2 80.64,76.2 81.28,76.83 81.28,78.11 82.55,79.38 82.55,81.12 X20.1
OUT21
  Bottom 0.203: IC10.14 R20.1 81.28,76.2 83.19,76.2 83.82,76.83 83.82,78.11 85.72,80.01 85.72,81.12 X22.2
OUT22
  Bottom 0.203: IC10.13 R19.1 83.82,76.2 85.72,76.2 86.36,76.83 86.36,78.11 88.9,80.64 88.9,80.8 X22.1
OUT23
  Bottom 0.203: IC10.12 R18.1 86.36,76.2 90.17,76.2 92.71,78.74 92.71,81.12 X23.2
OUT24
  Bottom 0.203: IC10.11 R17.1 90.81,74.93 96.52,80.64 96.52,81.12 X23.1
PULLUP3
  Top 0.61: R17.2 92.08,77.47 92.71,78.11 95.89,78.11 96.52,77.47 JP9.1 101.6,76.2 X26.2
  Top 0.813: R28.2 R27.2 R20.2 R19.2 R18.2 R17.2
R1_C1  (via drill 0.7)
  Top 0.203: X9.1 5.56,36.83 8.89,36.83 R21.1 12.7,38.1 12.7,38.73 14.61,40.64 v22.23,40.64
  Bottom 0.203: K1.4 22.86,24.77 22.86,27.3 24.77,29.21 24.77,31.11 22.23,33.66 22.23,34.92 22.86,35.56 22.23,36.2 v22.23,40.64
R1_C2
  Top 0.203: K1.13 JP2.1
R1_GND
  Top 0.203: R22.2 4.29,42.55 X10.2
  Bottom 0.203: R22.2 7.62,41.91 C3.1
  Bottom 0.406: X9.2 3.96,35.08 6.35,37.47 6.35,39.52 X10.2
R1_NC1
  Top 0.203: K1.6 26.04,17.78 27.94,19.68 29.21,19.68 JP1.1
R1_NC2
  Top 0.203: K1.11 JP4.1
R1_NO1
  Top 0.203: C4.1 3.96,45.72 X10.1
  Bottom 0.203: K1.8 18.41,12.7 16.51,10.79 7.62,10.79 7.62,30.11 11.17,33.66 12.06,34.55 12.06,46.09 11.17,46.99 9.53,46.99 C4.1
R1_NO2
  Top 0.203: K1.9 JP3.1
R2_C1  (via drill 0.7)
  Top 0.203: K2.4 30.48,27.3 v19.68,27.3 | R25.1 8.26,54.61 5.87,54.61 X11.1
  Bottom 0.203: v19.68,27.3 19.05,27.94 19.05,54.61 17.78,55.88 13.97,55.88 13.34,56.52 R25.1
R2_C2
  Bottom 0.203: K2.13 JP6.1
R2_GND
  Top 0.203: R26.2 4.29,49.53 X11.2
  Bottom 0.203: R26.2 7.62,50.16 8.89,51.44 9.53,51.44 C5.1
  Bottom 0.406: X12.2 3.81,55.88 6.35,53.34 6.35,51.59 X11.2
R2_NC1
  Top 0.203: JP5.1 43.81,19.05 36.2,19.05 K2.6
R2_NC2
  Bottom 0.203: K2.11 JP8.1
R2_NO1  (via drill 0.7)
  Top 0.203: C6.1 3.96,59.69 X12.1 | v20.95,25.4 28.57,25.4 33.66,20.32 33.66,13.97 K2.8
  Bottom 0.203: v20.95,25.4 20.95,27.94 19.68,29.21 19.68,56.52 17.78,58.42 15.24,58.42 12.06,61.59 10.16,61.59 C6.1
R2_NO2
  Bottom 0.203: K2.9 JP7.1
RESET  (via drill 0.7)
  Top 0.203: S4.4 S4.3 69.49,30.2 R29.1 | R29.1 70.48,29.21 ISP.5 | IC3.1 91.44,57.15 90.17,55.88 86.36,55.88 83.82,53.34 78.74,53.34 76.2,55.88 73.03,55.88 v71.75,57.15 | v70.48,32.38 70.48,30.48 R29.1
  Bottom 0.203: v71.75,57.15 71.75,33.66 v70.48,32.38
RUN1
  Top 0.203: R23.2 71.12,20.32 97.79,20.32 IC3.15
RUN2
  Top 0.203: R24.2 61.59,20.95 95.25,20.95 100.97,26.67 IC3.16
SCK
  Top 0.203: IC3.19 100.97,34.29 97.16,30.48 92.08,30.48 91.44,29.84 91.44,27.94 90.17,26.67 83.82,26.67 81.92,28.57 81.92,30.48 81.28,31.11 79.38,31.11 ISP.3
STATUS
  Top 0.203: R42.2 51.44,21.59 91.44,21.59 IC3.14
VCC  (via drill 0.7)
  Top 0.203: R29.2 72.39,27.3 73.03,27.94 78.74,27.94 ISP.2
  Top 0.61: R39.2 77.47,11.43 80.64,8.26 R41.2 78.74,6.35 78.11,5.71 78.11,2.54 78.74,1.91 89.53,1.91 90.81,3.17 97.16,3.17 99.69,5.71 IC4.16 101.6,9.53 104.14,12.06 104.14,35.56 102.87,36.83 | JP10.1 73.66,76.2 73.03,76.83 73.03,78.74 75.41,81.12 X18.1 | 102.87,36.83 IC3.20 | 102.87,36.83 104.14,38.1 104.14,66.02 X17.1 | C2.1 95.89,67.94 96.52,68.58 101.58,68.58 | IC9.20 85.09,57.15 83.82,55.88 77.47,55.88 76.2,57.15 IC5.20 73.03,59.05 64.77,59.05 62.87,57.15 IC2.20 59.05,57.15 57.78,55.88 50.8,55.88 IC11.20 47.62,59.05 v40.64,59.05 38.73,59.05 IC1.20 33.66,57.15 32.38,55.88 25.4,55.88 IC6.20
  Top 0.813: R39.2 R40.2 R45.2 R46.2 R47.2 R48.2 R49.2 R50.2 49.53,11.43 R30.2 44.45,10.16 43.18,10.16 R43.2 39.37,10.16 38.1,10.16 R44.2 34.29,10.16 33.02,10.16 R51.2 29.21,10.16 27.94,10.16 R52.2 24.13,10.16 22.86,10.16 R53.2 19.05,10.16 17.78,10.16 R54.2 | R31.2 16.51,30.48 K1.1 22.86,28.57 33.02,28.57 K2.1 | R54.2 13.97,10.16 12.7,10.16 R55.2 C1.1 | R54.2 R38.2 | X17.1 101.58,68.58
  Bottom 0.813: JP10.1 JP11.1 C2.1 93.34,67.94 92.08,66.67 92.08,59.05 90.17,57.15 | R38.2 R37.2 R36.2 R35.2 R34.2 R33.2 R32.2 R31.2 | IC3.7 92.08,41.91 90.81,43.18 90.81,56.52 90.17,57.15 | 90.17,57.15 IC9.20 89.53,57.15 | X19.1 40.48,79.22 39.37,78.11 39.37,62.23 40.64,60.96 v40.64,59.05 | ISP.2 80.01,26.04 78.11,24.13 78.11,12.06 77.47,11.43 R39.2